# Altium schematic sheet MCU.SchDoc
size A4
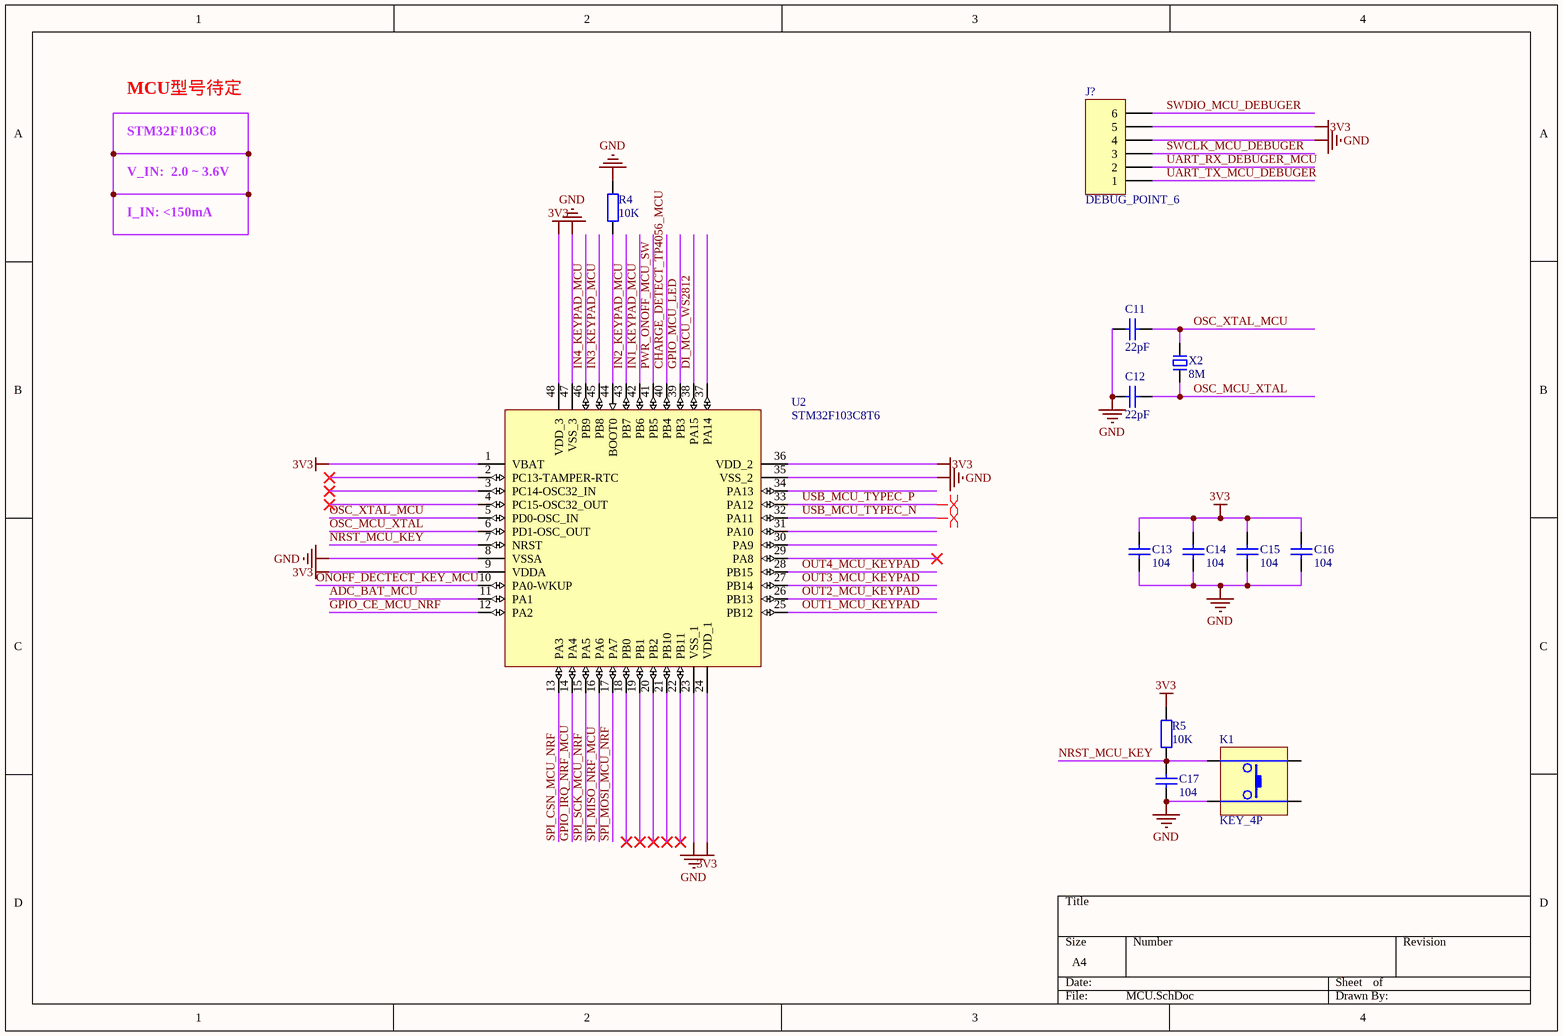
[diagram p0: MCU.SchDoc]

## Parts
C11  22pF  [Cap-0603]
C12  22pF  [Cap-0603]
C13  104  [Cap-0603]
C14  104  [Cap-0603]
C15  104  [Cap-0603]
C16  104  [Cap-0603]
C17  104  [Cap-0603]
J?  DEBUG_POINT_6  [DEBUG_POINT_6]
K1  KEY_4P  [SW-SMD-3X4X2.5]
R4  10K  [Res-0603]
R5  10K  [Res-0603]
U2  STM32F103C8T6  [STM32F103C8T6]
X2  8M  [OSC 5032-2P]

## Nets
3V3: C13.2 C14.2 C15.2 C16.2 J?.5 R5.2 U2.1(VBAT) U2.9(VDDA) U2.24(VDD_1) U2.36(VDD_2) U2.48(VDD_3)
GND: C11.1 C12.1 C13.1 C14.1 C15.1 C16.1 C17.1 J?.4 K1.4 R4.2 U2.8(VSSA) U2.23(VSS_1) U2.35(VSS_2) U2.47(VSS_3)
ADC_BAT_MCU: U2.11(PA1)
CHARGE_DETECT_TP4056_MCU: U2.40(PB4)
DI_MCU_WS2812: U2.38(PA15)
GPIO_CE_MCU_NRF: U2.12(PA2)
GPIO_IRQ_NRF_MCU: U2.14(PA4)
GPIO_MCU_LED: U2.39(PB3)
IN1_KEYPAD_MCU: U2.42(PB6)
IN2_KEYPAD_MCU: U2.43(PB7)
IN3_KEYPAD_MCU: U2.45(PB8)
IN4_KEYPAD_MCU: U2.46(PB9)
NRST_MCU_KEY: C17.2 K1.3 R5.1 U2.7(NRST)
ONOFF_DECTECT_KEY_MCU: U2.10(PA0-WKUP)
OSC_MCU_XTAL: C12.2 U2.6(PD1-OSC_OUT) X2.1
OSC_XTAL_MCU: C11.2 U2.5(PD0-OSC_IN) X2.2
OUT1_MCU_KEYPAD: U2.25(PB12)
OUT2_MCU_KEYPAD: U2.26(PB13)
OUT3_MCU_KEYPAD: U2.27(PB14)
OUT4_MCU_KEYPAD: U2.28(PB15)
PWR_ONOFF_MCU_SW: U2.41(PB5)
SPI_CSN_MCU_NRF: U2.13(PA3)
SPI_MISO_NRF_MCU: U2.16(PA6)
SPI_MOSI_MCU_NRF: U2.17(PA7)
SPI_SCK_MCU_NRF: U2.15(PA5)
SWCLK_MCU_DEBUGER: J?.3
SWDIO_MCU_DEBUGER: J?.6
UART_RX_DEBUGER_MCU: J?.2
UART_TX_MCU_DEBUGER: J?.1
USB_MCU_TYPEC_N: U2.32(PA11)
USB_MCU_TYPEC_P: U2.33(PA12)
NetR4_1: R4.1 U2.44(BOOT0)

Not connected (* = marked no-connect by the designer): K1 1 2; U2 2(PC13-TAMPER-RTC)* 3(PC14-OSC32_IN)* 4(PC15-OSC32_OUT)* 18(PB0)* 19(PB1)* 20(PB2)* 21(PB10)* 22(PB11)* 29(PA8)* 30(PA9) 31(PA10) 34(PA13) 37(PA14)

## Layout directives
differential pair: USB_MCU_TYPEC_N, USB_MCU_TYPEC_P

## Notes on the sheet
- MCU型号待定
- STM32F103C8
- V_IN:  2.0～3.6V
- I_IN: <150mA

## Library data of the parts
C11-C17 = CAP: 贴片陶瓷电容
R4 R5 = RES: 贴片电阻
U2 = STM32F103C8T6: ARM Cortex-M3 32-bit MCU, 64 KB Flash, 20 KB Internal RAM, 37 I/Os, 48-pin LQFP, -40 to 85 degC, Tray; A/D Converter: 2x12-bit (10 Channel); FLASH Size (Prog) (kB): 64; I/Os (High Current): 37; Internal RAM Size (kB): 20; Operating Frequency(F) (Processor speed) (MHz): 72; Supply Voltage(Vcc) min (V): 2; DatasheetVersion: Rev. 16; PackageVersion: Rev. 6, 06/2013; PackageReference: LQFP48; PackageDescription: 48-Pin Low Profile Quad Flat Package, 7 x 7 mm Body, 0.5 mm Pitch; Supplier 1: Digi-Key; Supplier Part Number 1: 497-6063-ND; Supplier 2: Farnell; Supplier Part Number 2: 1447637; Supplier 3: Newark; Supplier Part Number 3: 59M2182; Supplier 4: Newark; Supplier Part Number 4: 57P1222; Supplier 5: Mouser; Supplier Part Number 5: 511-STM32F103C8T6; Core: ARM Cortex-M3; Packing: Tray; Mounting Technology: Surface Mount; PartNumber: STM32F103C8T6; ComponentLink1Description: Manufacturer URL; ComponentLink1URL: http://www.st.com/web/en/home.html; ComponentLink2Description: Datasheet; ComponentLink2URL: http://www.st.com/st-web-ui/static/active/en/resource/technical/document/datasheet/CD00161566.pdf; ComponentLink3Description: Package Specification; ComponentLink3URL: http://www.st.com/st-web-ui/static/active/en/resource/technical/document/datasheet/DM00058181.pdf
X2 = XTAL-2P: 2脚无源脚晶振